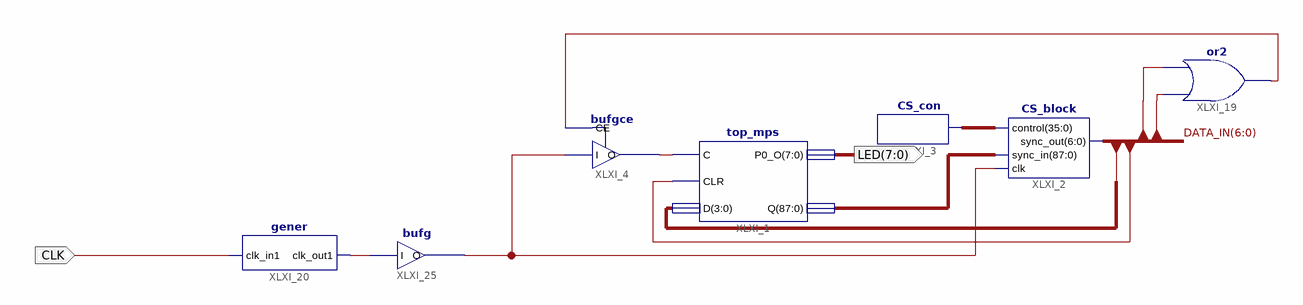
[diagram p0: schematic sheet 1]
// Xilinx ISE schematic top_top.sch (spartan6) as structural Verilog: 7 symbols, 2 ports
module top_top (
  input  CLK,
  output [7:0] LED
);

  wire XLXN_3, XLXN_21, XLXN_38, XLXN_39;
  wire [6:0] DATA_IN;
  wire [35:0] XLXN_28;
  wire [87:0] XLXN_29;

  CS_block XLXI_2 (.control(XLXN_28), .sync_in(XLXN_29), .clk(XLXN_39), .sync_out(DATA_IN));
  top_mps XLXI_1 (.C(XLXN_21), .CLR(DATA_IN[2]), .D(DATA_IN[6:3]), .P0_O(LED), .Q(XLXN_29));
  CS_con XLXI_3 (.control0(XLXN_28));
  bufgce XLXI_4 (.CE(XLXN_3), .I(XLXN_39), .O(XLXN_21));
  or XLXI_19 (XLXN_3, DATA_IN[0], DATA_IN[1]);
  gener XLXI_20 (.clk_in1(CLK), .clk_out1(XLXN_38));
  bufg XLXI_25 (.I(XLXN_38), .O(XLXN_39));
endmodule
